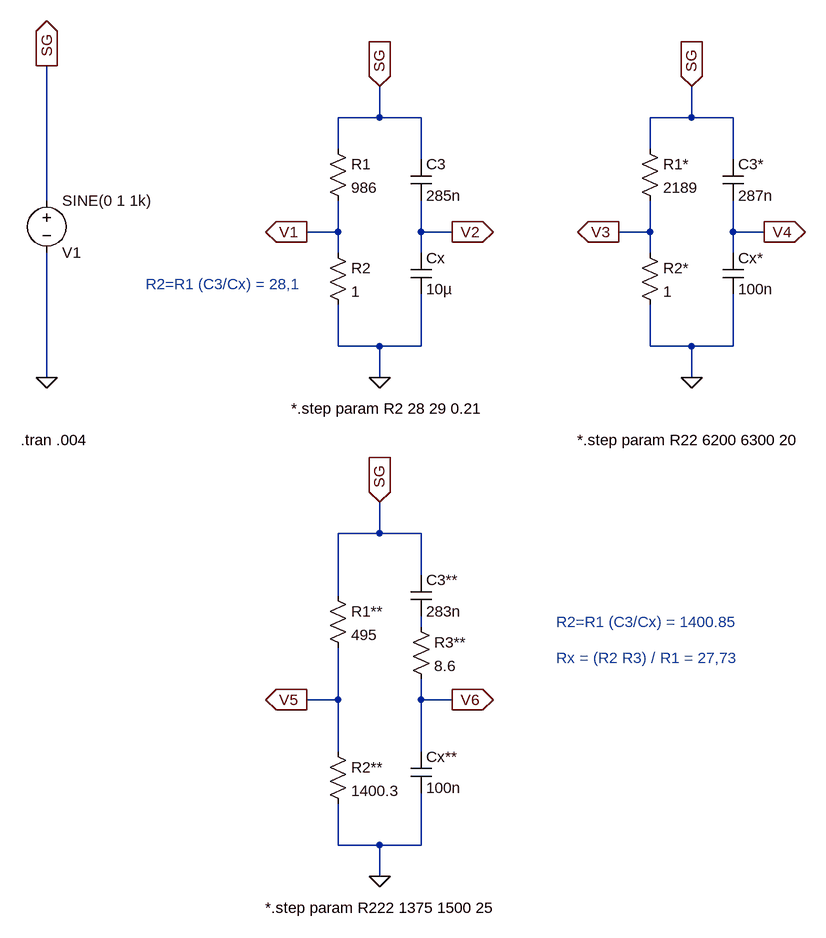
[diagram p0: schematic Sauty-Wien.asc]
Sauty-Wien.asc, the LTspice schematic file:
Version 4
SHEET 1 1416 1248
WIRE 112 16 112 -32
WIRE 112 16 48 16
WIRE 176 16 112 16
WIRE 592 16 592 -32
WIRE 592 16 528 16
WIRE 656 16 592 16
WIRE 48 64 48 16
WIRE 528 64 528 16
WIRE 176 80 176 16
WIRE 656 80 656 16
WIRE -400 144 -400 -64
WIRE 48 192 48 144
WIRE 48 192 0 192
WIRE 176 192 176 144
WIRE 224 192 176 192
WIRE 528 192 528 144
WIRE 528 192 480 192
WIRE 656 192 656 144
WIRE 704 192 656 192
WIRE 48 224 48 192
WIRE 176 224 176 192
WIRE 528 224 528 192
WIRE 656 224 656 192
WIRE 48 368 48 304
WIRE 112 368 48 368
WIRE 176 368 176 288
WIRE 176 368 112 368
WIRE 528 368 528 304
WIRE 592 368 528 368
WIRE 656 368 656 288
WIRE 656 368 592 368
WIRE -400 416 -400 224
WIRE 112 416 112 368
WIRE 592 416 592 368
WIRE 112 656 112 608
WIRE 112 656 48 656
WIRE 176 656 112 656
WIRE 176 720 176 656
WIRE 48 752 48 656
WIRE 176 800 176 784
WIRE 48 912 48 832
WIRE 48 912 0 912
WIRE 176 912 176 880
WIRE 224 912 176 912
WIRE 48 992 48 912
WIRE 176 992 176 912
WIRE 48 1136 48 1072
WIRE 112 1136 48 1136
WIRE 176 1136 176 1056
WIRE 176 1136 112 1136
WIRE 112 1184 112 1136
FLAG 112 416 0
FLAG 0 192 V1
IOPIN 0 192 Out
FLAG 224 192 V2
IOPIN 224 192 Out
FLAG 592 416 0
FLAG 480 192 V3
IOPIN 480 192 Out
FLAG 704 192 V4
IOPIN 704 192 Out
FLAG -400 416 0
FLAG -400 -64 SG
IOPIN -400 -64 Out
FLAG 112 -32 SG
IOPIN 112 -32 In
FLAG 592 -32 SG
IOPIN 592 -32 In
FLAG 112 1184 0
FLAG 0 912 V5
IOPIN 0 912 Out
FLAG 224 912 V6
IOPIN 224 912 Out
FLAG 112 608 SG
IOPIN 112 608 In
SYMBOL voltage -400 128 R0
WINDOW 0 24 96 Left 2
WINDOW 3 24 16 Left 2
WINDOW 123 0 0 Left 0
WINDOW 39 0 0 Left 0
SYMATTR InstName V1
SYMATTR Value SINE(0 1 1k)
SYMBOL cap 160 80 R0
SYMATTR InstName C3
SYMATTR Value 285n
SYMBOL cap 160 224 R0
SYMATTR InstName Cx
SYMATTR Value 10µ
SYMBOL res 32 48 R0
SYMATTR InstName R1
SYMATTR Value 986
SYMBOL res 32 208 R0
SYMATTR InstName R2
SYMATTR Value 1
SYMBOL cap 640 80 R0
SYMATTR InstName C3*
SYMATTR Value 287n
SYMBOL cap 640 224 R0
SYMATTR InstName Cx*
SYMATTR Value 100n
SYMBOL res 512 48 R0
SYMATTR InstName R1*
SYMATTR Value 2189
SYMBOL res 512 208 R0
SYMATTR InstName R2*
SYMATTR Value 1
SYMBOL cap 160 720 R0
SYMATTR InstName C3**
SYMATTR Value 283n
SYMBOL cap 160 992 R0
SYMATTR InstName Cx**
SYMATTR Value 100n
SYMATTR SpiceLine Rser=10
SYMBOL res 32 736 R0
SYMATTR InstName R1**
SYMATTR Value 495
SYMBOL res 32 976 R0
SYMATTR InstName R2**
SYMATTR Value 1400.3
SYMBOL res 160 784 R0
SYMATTR InstName R3**
SYMATTR Value 8.6
TEXT -440 512 Left 2 !.tran .004
TEXT 416 512 Left 2 !*.step param R22 6200 6300 20
TEXT -64 1232 Left 2 !*.step param R222 1375 1500 25
TEXT -248 272 Left 2 ;R2=R1 (C3/Cx) = 28,1
TEXT 384 792 Left 2 ;R2=R1 (C3/Cx) = 1400.85
TEXT 384 848 Left 2 ;Rx = (R2 R3) / R1 = 27,73
TEXT -24 464 Left 2 !*.step param R2 28 29 0.21

The netlist it stands for:
* Sauty-Wien.asc
V1 SG 0 SINE(0 1 1k)
C3 SG V2 285n
Cx V2 0 10µ
R1 SG V1 986
R2 V1 0 1
C3* SG V4 287n
Cx* V4 0 100n
R1* SG V3 2189
R2* V3 0 1
C3** SG N001 283n
Cx** V6 0 100n Rser=10
R1** SG V5 495
R2** V5 0 1400.3
R3** N001 V6 8.6
.tran .004
*.step param R22 6200 6300 20
*.step param R222 1375 1500 25
* R2=R1 (C3/Cx) = 28,1
* R2=R1 (C3/Cx) = 1400.85
* Rx = (R2 R3) / R1 = 27,73
*.step param R2 28 29 0.21
.backanno
.end